# Altium project Plant.PrjPcb
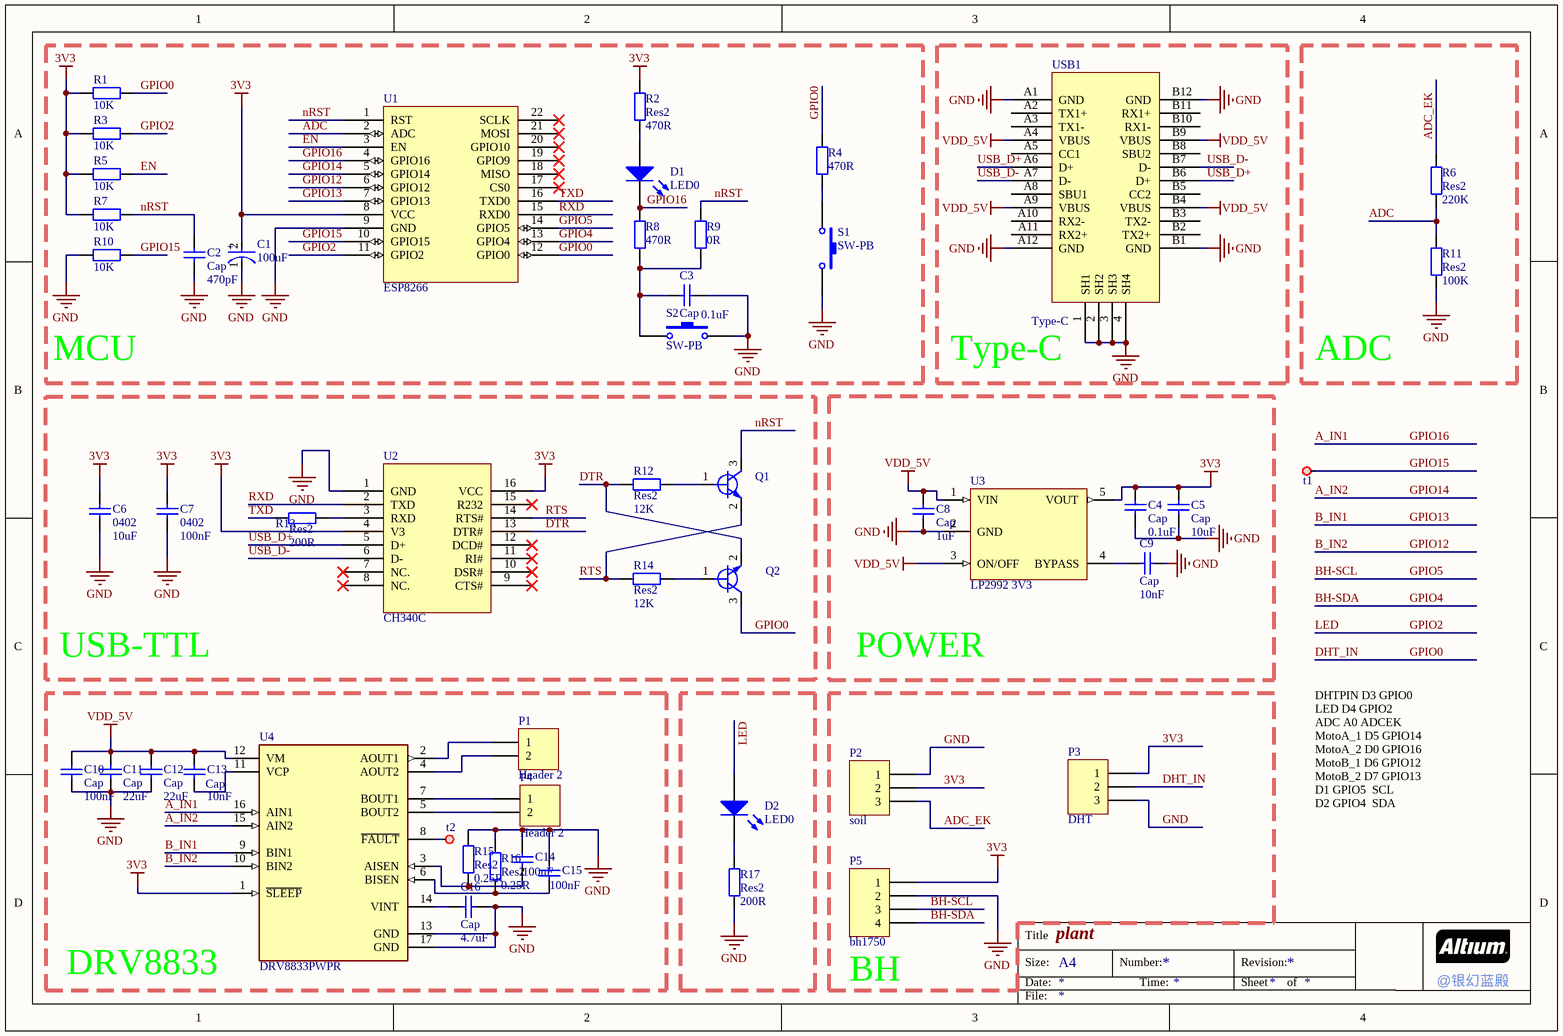
[diagram p0: Plant.SchDoc]
1 sheet, 51 parts. Net scope: global (net labels, ports and power ports of the same name join across sheets).
Board file: Plant.PcbDoc

## Sheet Plant.SchDoc: plant
size A4; Author: yhld; DrawnBy: yhld

### Parts
C1  100uF  [FP-T495D107K016ATE125-MFG]
C2  Cap  value 470pF  [C 0402_M]
C3  Cap  value 0.1uF  [C 0402_M]
C4  Cap  value 0.1uF  [C 0402_M]
C5  Cap  value 10uF  [C 0402_M]
C6  0402  value 10uF  [C 0402_M]
C7  0402  value 100nF  [C 0402_M]
C8  Cap  value 1uF  [C 0402_M]
C9  Cap  value 10nF  [C 0402_M]
C10  Cap  value 100nF  [C 0402_M]
C11  Cap  value 22uF  [C 0402_M]
C12  Cap  value 22uF  [C 0402_M]
C13  Cap  value 10nF  [C 0402_M]
C14  value 100nF  [C 0402_M]
C15  value 100nF  [C 0402_M]
C16  Cap  value 4.7uF  [C 0402_M]
D1  LED0  [LED 0603R]
D2  LED0  [LED 0603R]
P1  Header 2  [HDR1X2]
P2  soil  [HDR1X3]
P3  DHT  [HDR1X3]
P4  Header 2  [HDR1X2]
P5  bh1750  [HDR1X4]
Q1  Y1 NPN SOT23-3  [SMT_TRIODE_NPN]  (value not drawn)
Q2  Y1 NPN SOT23-3  [SMT_TRIODE_NPN]  (value not drawn)
R1  value 10K  [R 0402_M]  (hidden comment: 0402)
R2  Res2  value 470R  [R 0402_M]
R3  value 10K  [R 0402_M]  (hidden comment: 0402)
R4  value 470R  [R 0402_M]  (hidden comment: Res2)
R5  value 10K  [R 0402_M]  (hidden comment: 0402)
R6  Res2  value 220K  [R 0402_M]
R7  value 10K  [R 0402_M]  (hidden comment: 0402)
R8  value 470R  [R 0402_M]  (hidden comment: Res2)
R9  value 0R  [R 0402_M]  (hidden comment: Res2)
R10  value 10K  [R 0402_M]  (hidden comment: 0402)
R11  Res2  value 100K  [R 0402_M]
R12  Res2  value 12K  [R 0402_M]
R13  Res2  value 200R  [R 0402_M]
R14  Res2  value 12K  [R 0402_M]
R15  Res2  value 0.25R  [R 1206_M]
R16  Res2  value 0.25R  [R 1206_M]
R17  Res2  value 200R  [R 0402_M]
S1  SW-PB  [TSW DIP-6*6*5]
S2  SW-PB  [TSW DIP-6*6*5]
t1  test  [test]  (value not drawn)
t2  test  [test]  (value not drawn)
U1  ESP8266  [esp8266]
U2  CH340C  [CH340]
U3  LP2992 3V3  [SOT23-5N]
U4  DRV8833PWPR  [FP-PWP0016C-IPC_A]
USB1  Type-C  [Type-C-TOP]

### Blocks framed on the sheet
MCU: C1-C3 D1 R1-R5 R7-R10 S1 S2 U1
Type-C: USB1
ADC: R6 R11
USB-TTL: C6 C7 Q1 Q2 R12-R14 U2
POWER: C4 C5 C8 C9 U3
DRV8833: C10-C16 P1 P4 R15 R16 t2 U4
BH: P2 P3 P5

### Nets
3V3: C1.2(A) C4.1 C5.1 C6.2 C7.2 P2.2 P3.1 P5.1 R1.1 R2.1 R3.1 R5.1 R7.1 U1.8(VCC) U2.4(V3) U2.16(VCC) U3.5(VOUT) U4.1(~{SLEEP})
GND: C1.1(C) C2.2 C3.2 C4.2 C5.2 C6.1 C7.1 C8.2 C9.2 C10.2 C11.2 C12.2 C14.2 C15.2 C16.1 P2.1 P3.3 P5.2 R10.1 R11.2 R15.2 R16.2 R17.2 S1.2 S2.2 U1.9(GND) U2.1(GND) U3.2(GND) U4.13(GND) U4.17(GND) USB1.1(SH1) USB1.2(SH2) USB1.3(SH3) USB1.4(SH4) USB1.A1(GND) USB1.A12(GND) USB1.B1(GND) USB1.B12(GND)
VDD_5V: C8.1 C10.1 C11.1 C12.1 C13.2 U3.1(VIN) U3.3(ON/OFF) U4.12(VM) USB1.A4(VBUS) USB1.A9(VBUS) USB1.B4(VBUS) USB1.B9(VBUS)
A_IN1: D1.2(K) R8.2 U1.4(GPIO16) U4.16(AIN1)  [also labelled GPIO16]
A_IN2: U1.5(GPIO14) U4.15(AIN2)  [also labelled GPIO14]
ADC: R6.2 R11.1 U1.2(ADC)
ADC_EK: P2.3 R6.1
B_IN1: U1.7(GPIO13) U4.9(BIN1)  [also labelled GPIO13]
B_IN2: U1.6(GPIO12) U4.10(BIN2)  [also labelled GPIO12]
BH-SCL: P5.3 U1.14(GPIO5)  [also labelled GPIO5]
BH-SDA: P5.4 U1.13(GPIO4)  [also labelled GPIO4]
DHT_IN: P3.2 Q2.3(COLLECTOR) R1.2 R4.2 U1.12(GPIO0)  [also labelled GPIO0]
DTR: Q2.2(EMITTER) R12.1 U2.13(DTR#)
EN: R5.2 U1.3(EN)
GPIO2: D2.1(A) R3.2 U1.11(GPIO2)  [also labelled LED]
GPIO15: R10.2 t1.1(test) U1.10(GPIO15)
nRST: C2.1 Q1.3(COLLECTOR) R7.2 R9.2 U1.1(RST)
RTS: Q1.2(EMITTER) R14.1 U2.14(RTS#)
RXD: U1.15(RXD0) U2.2(TXD)
TXD: R13.1 U1.16(TXD0)
USB_D+: U2.5(D+) USB1.A6(D+) USB1.B6(D+)
USB_D-: U2.6(D-) USB1.A7(D-) USB1.B7(D-)
NetC3_1: C3.1 R8.1 R9.1 S2.1
NetC9_1: C9.1 U3.4(BYPASS)
NetC13_1: C13.1 U4.11(VCP)
NetC14_1: C14.1 R15.1 U4.3(AISEN)
NetC15_1: C15.1 R16.1 U4.6(BISEN)
NetC16_2: C16.2 U4.14(VINT)
NetD1_1: D1.1(A) R2.2
NetD2_2: D2.2(K) R17.1
NetP1_1: P1.1 U4.2(AOUT1)
NetP1_2: P1.2 U4.4(AOUT2)
NetP4_1: P4.1 U4.7(BOUT1)
NetP4_2: P4.2 U4.5(BOUT2)
NetQ1_1: Q1.1(BASE) R12.2
NetQ2_1: Q2.1(BASE) R14.2
NetR4_1: R4.1 S1.1
NetR13_2: R13.2 U2.3(RXD)
Nett2_1: t2.1(test) U4.8(~{FAULT})

Not connected (* = marked no-connect by the designer): U1 17(CS0)* 18(MISO)* 19(GPIO9)* 20(GPIO10)* 21(MOSI)* 22(SCLK)*; U2 7(NC.)* 8(NC.)* 9(CTS#)* 10(DSR#)* 11(RI#)* 12(DCD#)* 15(R232)*; USB1 A2(TX1+) A3(TX1-) A5(CC1) A8(SBU1) A10(RX2-) A11(RX2+) B2(TX2+) B3(TX2-) B5(CC2) B8(SBU2) B10(RX1-) B11(RX1+)

### Notes on the sheet
- DHTPIN D3 GPIO0
  LED D4 GPIO2
  ADC A0 ADCEK
  MotoA_1 D5 GPIO14
  MotoA_2 D0 GPIO16
  MotoB_1 D6 GPIO12
  MotoB_2 D7 GPIO13
  D1 GPIO5  SCL
  D2 GPIO4  SDA
- Title
- Size:
- Date:
- A4
- Number:
- Time:
- Revision:
- Sheet
- of
- @银幻蓝殿
- File:
- (in symbol CMP-2000-07207-2) +

### Library data of the parts
C1 = CMP-2000-07207-2: CAP TANT 100UF 10% 16V 2917; Life (Hours): 2000Hour; ESR (Equivalent Series Resistance): 125mR; Polarity: Polar; Dielectric Material: Tantalum; Dissipation Factor: 8%; Capacitance: 100uF; Radiation Hardening: No; RoHS Compliant: Yes; Length: 7.3mm; Features: General Purpose; Packaging: Tape and Reel; Package Quantity: 1; Weight: 0.023634oz; Voltage Rating: 16V; Width: 0.169inch; Case/Package: 2917; Mount: Surface Mount; Voltage: 16V; Min Operating Temperature: -55°C; Tolerance: 10%; REACH SVHC: No SVHC; Height - Seated (Max): 0.122inch; Number of Pins: 2; Construction: Flat; Depth: 4.3mm; Series: T495; Max Operating Temperature: 125°C; Failure Rate: 0.001%; Termination: SMD/SMT; Voltage Rating (DC): 16V; Case Code (Imperial): 2917; Case Code (Metric): 7343; Height: 2.8mm
C2-C16 = Cap Semi: Capacitor (Semiconductor SIM Model); Published: 8-Jun-2000; LatestRevisionDate: 29-May-2009; LatestRevisionNote: IPC-7351 Footprint Added.; PackageReference: C1206; Publisher: Altium Limited; PackageDescription: Chip Capacitor
D1 D2 = LED0: Typical INFRARED GaAs LED; Published: 8-Jun-2000; LatestRevisionDate: 08-Jul-2005; LatestRevisionNote: Mech Layer 1 removed.; PackageReference: LED-0; Publisher: Altium Limited; PackageDescription: LED; 2 Leads
P1 P4 = Header 2: Header, 2-Pin; LatestRevisionDate: 17-Jul-2002; LatestRevisionNote: Re-released for DXP Platform.; Publisher: Altium Limited
P2 P3 = Header 3: Header, 3-Pin; LatestRevisionDate: 17-Jul-2002; LatestRevisionNote: Re-released for DXP Platform.; Publisher: Altium Limited
P5 = Header 4: Header, 4-Pin; LatestRevisionDate: 17-Jul-2002; LatestRevisionNote: Re-released for DXP Platform.; Publisher: Altium Limited
Q1 Q2 = S8050
R1-R17 = Res2: Resistor; Published: 8-Jun-2000; LatestRevisionDate: 17-Jul-2002; LatestRevisionNote: Re-released for DXP Platform.; PackageReference: AXIAL-0.4; Publisher: Altium Limited; PackageDescription: Axial Device, Thru-Hole; 2 Leads; 0.4 in Pin Spacing
S1 S2 = SW-PB: Switch; Published: 24-Mar-1999; LatestRevisionDate: 17-Jul-2002; LatestRevisionNote: Re-released for DXP Platform.; PackageReference: SPST-2; Publisher: Altium Limited; PackageDescription: Switch; 2 Leads
U3 = LP2992: LDO
U4 = CMP-1529-00004-3: IC MOTOR DRIVER PAR 16HTSSOP; Supply Current: 3mA; Max Output Current: 2A; Interface: PWM; Output Current: 1.5A; Max Supply Voltage: 10.8V; Fault Protection: Over Temperature; Number of Outputs: 2; Min Supply Voltage: 2.7V; Nominal Supply Current: 3mA; Series: DRV8833; Min Operating Temperature: -40°C; Package Quantity: 2000; Packaging: Tape and Reel; Case/Package: HTSSOP; Output Current per Channel: 1.5A; RoHS Compliant: Yes; RMS Current (Irms): 1.5A; Max Operating Temperature: 85°C; Technology: NMOS; Number of Pins: 16; Radiation Hardening: No; Lead Free: Lead Free; REACH SVHC: No SVHC
USB1 = USB-Type-C-TOP